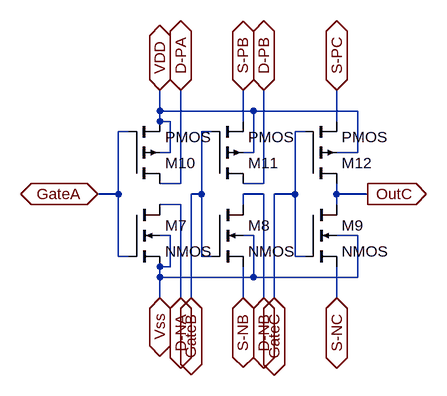
[diagram p0: schematic MC14007UB.asc]
MC14007UB.asc, the LTspice schematic file:
Version 4
SHEET 1 880 680
WIRE 64 0 64 -32
WIRE 208 0 64 0
WIRE 368 0 208 0
WIRE 64 16 64 0
WIRE 80 16 64 16
WIRE 192 16 192 -32
WIRE 336 16 336 -32
WIRE 16 32 0 32
WIRE 144 32 128 32
WIRE 288 32 272 32
WIRE 80 64 80 16
WIRE 80 64 64 64
WIRE 208 64 208 0
WIRE 208 64 192 64
WIRE 368 64 368 0
WIRE 368 64 336 64
WIRE 96 112 96 -32
WIRE 96 112 64 112
WIRE 224 112 224 -32
WIRE 224 112 192 112
WIRE 0 128 0 32
WIRE 0 128 -32 128
WIRE 128 128 128 32
WIRE 128 128 112 128
WIRE 224 128 192 128
WIRE 272 128 272 32
WIRE 272 128 240 128
WIRE 336 128 336 112
WIRE 384 128 336 128
WIRE 96 144 64 144
WIRE 192 144 192 128
WIRE 336 144 336 128
WIRE 80 192 64 192
WIRE 208 192 192 192
WIRE 368 192 336 192
WIRE 0 224 0 128
WIRE 16 224 0 224
WIRE 128 224 128 128
WIRE 144 224 128 224
WIRE 272 224 272 128
WIRE 288 224 272 224
WIRE 80 240 80 192
WIRE 80 240 64 240
WIRE 64 256 64 240
WIRE 208 256 208 192
WIRE 208 256 64 256
WIRE 368 256 368 192
WIRE 368 256 208 256
WIRE 64 288 64 256
WIRE 96 288 96 144
WIRE 112 288 112 128
WIRE 192 288 192 240
WIRE 224 288 224 128
WIRE 240 288 240 128
WIRE 336 288 336 240
FLAG 384 128 OutC
IOPIN 384 128 Out
FLAG -32 128 GateA
IOPIN -32 128 BiDir
FLAG 64 -32 VDD
IOPIN 64 -32 BiDir
FLAG 96 -32 D-PA
IOPIN 96 -32 BiDir
FLAG 192 -32 S-PB
IOPIN 192 -32 BiDir
FLAG 224 -32 D-PB
IOPIN 224 -32 BiDir
FLAG 336 -32 S-PC
IOPIN 336 -32 BiDir
FLAG 336 288 S-NC
IOPIN 336 288 BiDir
FLAG 240 288 GateC
IOPIN 240 288 BiDir
FLAG 224 288 D-NB
IOPIN 224 288 BiDir
FLAG 192 288 S-NB
IOPIN 192 288 BiDir
FLAG 112 288 GateB
IOPIN 112 288 BiDir
FLAG 96 288 D-NA
IOPIN 96 288 BiDir
FLAG 64 288 Vss
IOPIN 64 288 BiDir
SYMBOL nmos4 16 144 R0
SYMATTR InstName M7
SYMBOL nmos4 144 144 R0
SYMATTR InstName M8
SYMBOL nmos4 288 144 R0
SYMATTR InstName M9
SYMBOL pmos4 16 112 M180
SYMATTR InstName M10
SYMBOL pmos4 144 112 M180
SYMATTR InstName M11
SYMBOL pmos4 288 112 M180
SYMATTR InstName M12

The netlist it stands for:
* MC14007UB.asc
M7 D-NA GateA Vss Vss NMOS
M8 D-NB GateB S-NB Vss NMOS
M9 OutC GateC S-NC Vss NMOS
M10 D-PA GateA VDD VDD PMOS
M11 D-PB GateB S-PB VDD PMOS
M12 OutC GateC S-PC VDD PMOS
.model NMOS NMOS
.model PMOS PMOS
.lib standard.mos
.backanno
.end